# EAGLE design board_v2 (EAGLE 9.6.2)
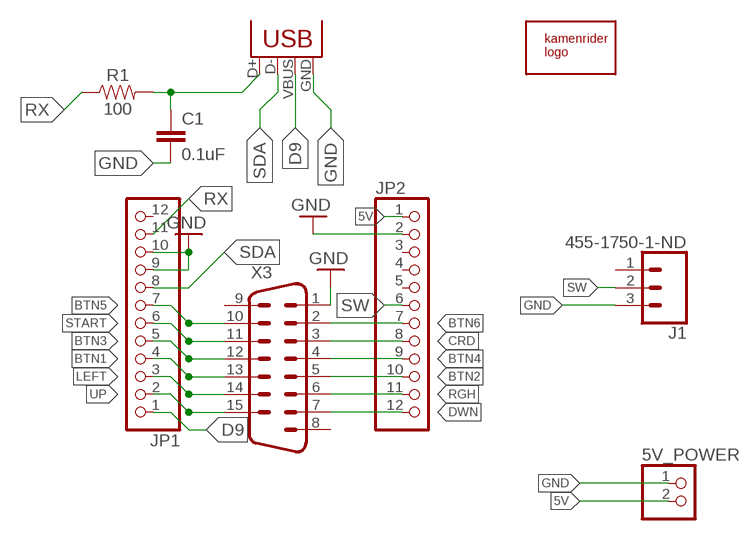
[diagram p0: schematic, sheet 1]

## Parts
5V_POWER  PINHD-1X02_2.54-S  [1X02-S]
C1  0.1uF  0.1UF-0603-25V-5%  [0603]
J1  455-1750-1-ND  CONN_03  [1X03]
JP1  PINHD-1X12  [1X12]
JP2  PINHD-1X12  [1X12]
R1  100  100OHM-0603-1/10W-1%  [0603]
U$1  KAMENRIDER_LOGOV2_COLOR_OPAC  [10_6_V2]
X2  USB-B-H  [USB-B-H]
X3  M15V  [M15V]

## Nets
5V: 5V_POWER.2 JP2.1
BTN1: JP1.4 X3.13
BTN2: JP2.10 X3.5
BTN3: JP1.5 X3.12
BTN4: JP2.9 X3.4
BTN5: JP1.7 X3.10
BTN6: JP2.7 X3.2
CRD: JP2.8 X3.3
D9: JP1.1 X2.VBUS
DWN: JP2.12 X3.7
GND: 5V_POWER.1 C1.2 J1.3 JP1.9 JP1.10 JP2.2 X2.GND X3.1
LEFT: JP1.3 X3.14
RGH: JP2.11 X3.6
RX: JP1.11 R1.1
RX_R: C1.1 R1.2 X2.D+
SDA: JP1.8 X2.D-
START: JP1.6 X3.11
SW: J1.2 JP2.6
UP: JP1.2 X3.15
Unconnected: J1.1 JP1.12 JP2.3 JP2.4 JP2.5 X3.8 X3.9

## Library data of the parts
5V_POWER = pinhead-2:PINHD-1X02: PIN HEADER
C1 = SparkFun-Capacitors:0.1UF: 0.1µF ceramic capacitors A capacitor is a passive two-terminal electrical component used to store electrical energy temporarily in an electric field.; PROD_ID: CAP-08604
J1 = SparkFun-Connectors:CONN_03: Multi connection point. Often used as Generic Header-pin footprint for 0.1 inch spaced/style header connections On any of the 0.1 inch spaced packages, you can populate with these: Break Away Headers - Straight <https://www.sparkfun.com/products/116> (PRT-00116) Break Away Male Headers - Right Angle <https://www.sparkfun.com/products/553> (PRT-00553) Female Headers <https://www.sparkfun.com/products/115> (PRT-00115) Break Away Headers - Machine Pin <https://www.sparkfun.com/products/117> (PRT-00117) Break Away Female Headers - Swiss Machine Pin <https://www.sparkfun.com/products/743> (PRT-00743) Stackable Header - 3 Pin (Female, 0.1") <https://www.sparkfun.com/products/13875> (PRT-13875) For SCREWTERMINALS and SPRING TERMINALS visit here: Screw Terimnals on SparkFun.com <https://www.sparkfun.com/search/results?term=Screw+Terminals> (5mm/3.5mm/2.54mm spacing) This device is also useful as a general connection point to wire up your design to another part of your project. Our various solder wires solder well into these plated through hole pads. Hook-Up Wire - Assortment (Stranded, 22 AWG) <https://www.sparkfun.com/products/11375> (PRT-11375) Hook-Up Wire - Assortment (Solid Core, 22 AWG) <https://www.sparkfun.com/products/11367> (PRT-11367) View the entire wire category on our website here <https://www.sparkfun.com/categories/141> Special notes: Molex polarized connector foot print use with SKU : PRT-08232 with associated crimp pins and housings.; PROD_ID: XXX-00000
JP1 JP2 = adafruit:PINHD-1X12: PIN HEADER
R1 = SparkFun-Resistors:100OHM: 100Ω resistor A resistor is a passive two-terminal electrical component that implements electrical resistance as a circuit element. Resistors act to reduce current flow, and, at the same time, act to lower voltage levels within circuits. - Wikipedia; PROD_ID: RES-07863
U$1 = kamenrider:KAMENRIDER_LOGO
X2 = con-usb:USB: USB Connectors
X3 = con-subd:M15: SUB-D; OC_FARNELL: unknown; OC_NEWARK: unknown

## Net classes
0 default: width 0.203 mm

## Board
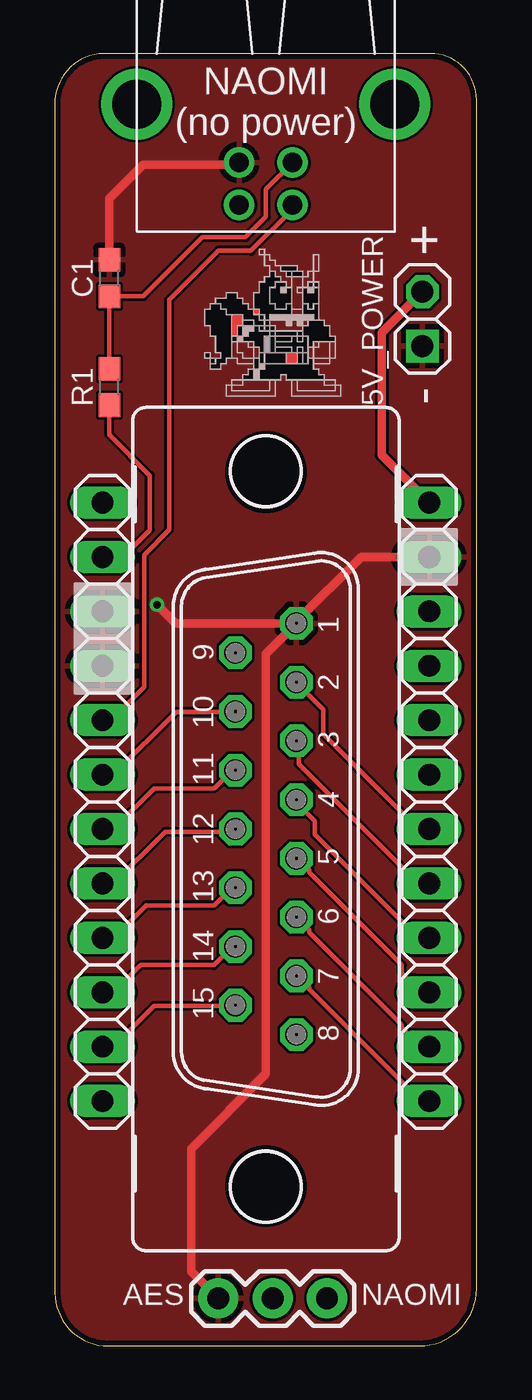
[diagram p1: board, top side]
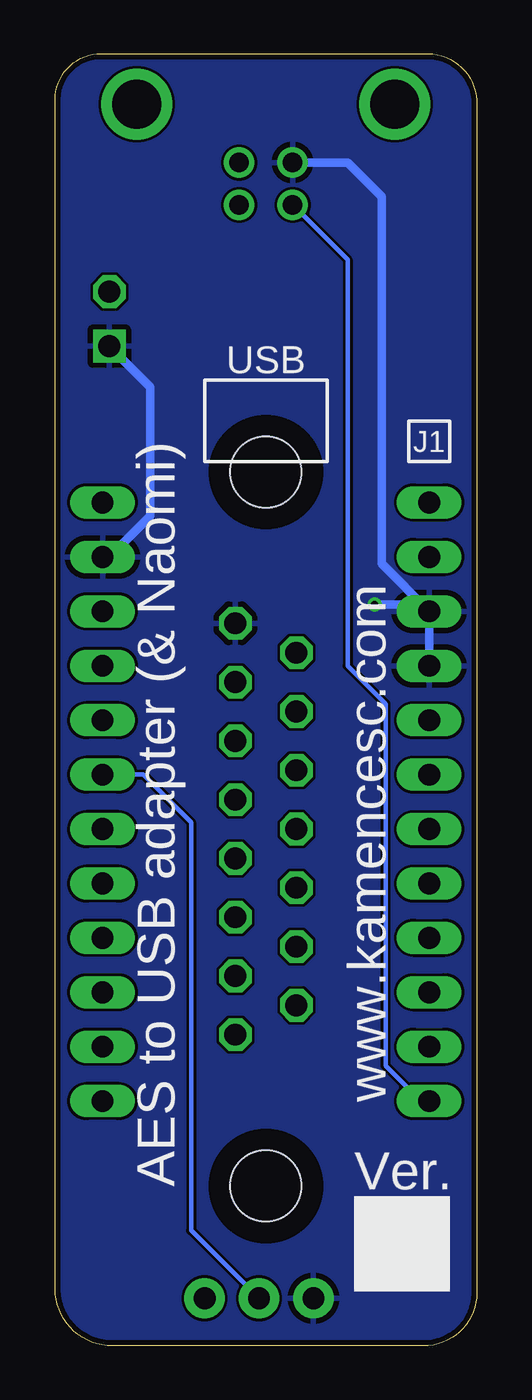
[diagram p2: board, bottom side, seen from below]

Size 19.67 x 60.33 mm. Coordinates in mm from the lower left corner, seen from the top.
Outline: 0,58.16 0,2.49 arc90 2.49,0 17.01,0 arc90 19.67,2.66 19.67,58.18 arc90 17.53,60.33 2.49,60.33 arc90 0,58.16
Copper layers (1*16): Top 0.035mm / dielectric 1.5mm / Bottom 0.035mm
Design rules "dirtypcbs_2_layer": minimum track width 5mil, minimum drill 12mil, track to track 5mil, track to pad 5mil, pad to pad 5mil, via to via 5mil, smd to smd 0mil, copper to edge 10mil, drill to drill 10mil, minimum pad ring 10mil, minimum via ring 6mil, stop-mask expansion 2mil, vias tented up to drill 25mil, thermal gap 10mil

### Footprints (pad centres in the part's own frame; a part is rotated, then mirrored left to right if it is on the bottom)
1X02-S = drill 1.016 square: 1 -1.27,0 | drill 1.016 octagon: 2 1.27,0
0603 = smd 1.1 x 1: 1 -0.85,0; 2 0.85,0
1X03 = drill 1.016 pad 1.88: 1 0,0; 2 2.54,0; 3 5.08,0
1X12 = drill 1.016 long: 1 -13.97,0; 2 -11.43,0; 3 -8.89,0; 4 -6.35,0; 5 -3.81,0; 6 -1.27,0; 7 1.27,0; 8 3.81,0; 9 6.35,0; 10 8.89,0; 11 11.43,0; 12 13.97,0
USB-B-H = drill 0.914: D+ 0,1.25; D- 1.981,1.25; GND 0,-1.25; VBUS 1.981,-1.25 | drill 2.286: P$1 -2.718,-6.02; P$2 -2.718,6.02
M15V = drill 1.016 octagon: 1 -9.601,1.422; 2 -6.858,1.422; 3 -4.115,1.422; 4 -1.372,1.422; 5 1.372,1.422; 6 4.115,1.422; 7 6.858,1.422; 8 9.601,1.422; 9 -8.23,-1.422; 10 -5.486,-1.422; 11 -2.743,-1.422; 12 0,-1.422; 13 2.743,-1.422; 14 5.486,-1.422; 15 8.23,-1.422 | hole 3.302: 16.662,0; -16.662,0

### Placement (x,y rotation side)
5V_POWER  17.14,47.94 90 top
C1  2.54,49.85 90 top
J1  12.7,2.22 180 top
JP1  2.22,25.4 90 top
JP2  17.46,25.4 270 top
R1  2.54,44.77 90 top
U$1  6.67,43.81 0 top
X2  9.84,55.24 270 top
X3  9.84,24.13 270 top

### Tracks (layer width: path | path; a pad name or v marks a point on that pad's centre or on a via)
5V
  Top 0.406: 5V_POWER.2 15.24,47.31 15.24,41.59 JP2.1
BTN1
  Top 0.203: JP1.4 2.73,19.05 4.25,20.57 7.43,20.57 8.32,21.46 X3.13
BTN2
  Top 0.203: JP2.10 17.08,16.51 16.19,17.4 16.19,17.78 11.87,22.1 11.87,22.23 11.37,22.73 X3.5
BTN3
  Top 0.203: JP1.5 2.73,21.59 5.14,24 8.19,24 8.32,24.13 X3.12
BTN4
  Top 0.203: JP2.9 16.95,19.05 12.13,23.88 12.13,24.51 11.24,25.4 X3.4
BTN5
  Top 0.203: JP1.7 2.73,26.67 5.65,29.59 8.32,29.59 X3.10
BTN6
  Top 0.203: JP2.7 16.95,24.13 12.51,28.57 12.51,29.72 11.24,30.99 X3.2
CRD
  Top 0.203: JP2.8 16.95,21.59 11.37,27.18 11.37,28.19 X3.3
D9
  Bottom 0.203: JP1.1 2.6,11.43 4.25,13.08 4.25,29.97 6.03,31.75 6.03,50.7 X2.VBUS
DWN
  Top 0.203: JP2.12 17.08,11.43 11.87,16.64 11.87,16.76 11.37,17.27 X3.7
GND  (via drill 0.35)
  Top 0.406: JP2.2 14.29,36.83 11.26,33.81 X3.1 | X3.1 5.64,33.73 v4.76,34.61 | X3.1 9.84,32.31 9.84,12.7 6.35,9.21 6.35,3.49 J1.3 | C1.2 2.54,53.55 4.13,55.14 8.49,55.14 X2.GND
  Bottom 0.406: v4.76,34.61 2.54,34.61 JP1.10 | JP1.10 JP1.9 | JP1.10 4.45,36.51 4.45,53.66 6.03,55.24 X2.GND | 5V_POWER.1 15.24,44.77 15.24,38.73 17.15,36.83 JP2.2
  pour Top: 20.64,-1.27 -0.32,-1.27 -0.32,60.33 20.64,60.33
  pour Bottom: -0.95,60.96 21.27,60.96 21.27,-1.91 -0.95,-1.91
LEFT
  Top 0.203: JP1.3 2.73,16.51 4,17.78 7.43,17.78 8.32,18.67 X3.14
RGH
  Top 0.203: JP2.11 17.08,13.97 16.19,14.86 16.19,14.99 11.87,19.3 11.87,19.43 11.37,19.94 X3.6
RX
  Top 0.203: JP1.11 3.17,36.83 4.43,38.09 4.43,40.64 2.54,42.53 R1.1
RX_R
  Top 0.203: R1.2 C1.1 4.13,49 6.88,51.75 8.89,51.75 9.84,52.7 9.84,53.99 X2.D+
SDA
  Top 0.203: JP1.8 2.6,29.21 4.16,30.77 4.16,36.92 5.33,38.1 5.33,48.83 7.62,51.12 9.14,51.12 10.99,52.96 10.99,53.21 X2.D-
START
  Top 0.203: JP1.6 2.73,24.13 4.64,26.04 7.43,26.04 8.32,26.92 X3.11
SW
  Bottom 0.203: 16.95,26.67 JP2.6 15.56,26.67 13.34,24.45 13.34,5.4 J1.2
UP
  Top 0.203: JP1.2 2.73,13.97 4.64,15.88 8.32,15.88 X3.15

### Text on the board
tPlace: + | -
bPlace: USB | J1 | Ver.
tNames: NAOMI | (no power) | AES | NAOMI
bNames: AES to USB adapter (& Naomi) | www.kamencesc.com